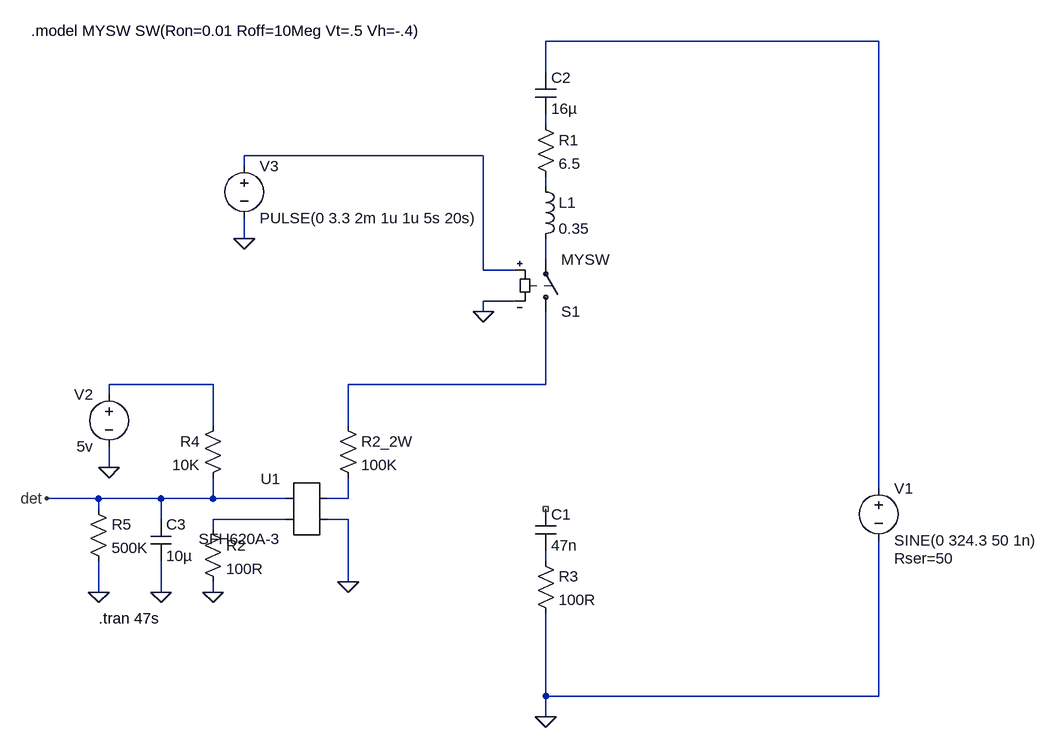
[diagram p0: schematic on_off_det.asc]
on_off_det.asc, the LTspice schematic file:
Version 4
SHEET 1 908 680
WIRE 432 -384 -80 -384
WIRE -80 -336 -80 -384
WIRE -80 -256 -80 -272
WIRE -176 -208 -544 -208
WIRE -544 -192 -544 -208
WIRE -80 -160 -80 -176
WIRE -544 -80 -544 -112
WIRE -80 -48 -80 -80
WIRE -176 -32 -176 -208
WIRE -128 -32 -176 -32
WIRE -128 16 -176 16
WIRE -176 32 -176 16
WIRE -592 144 -752 144
WIRE -80 144 -80 32
WIRE -80 144 -384 144
WIRE -752 160 -752 144
WIRE -592 208 -592 144
WIRE -384 208 -384 144
WIRE -752 272 -752 240
WIRE 432 304 432 -384
WIRE -768 320 -848 320
WIRE -672 320 -768 320
WIRE -592 320 -592 288
WIRE -592 320 -672 320
WIRE -480 320 -592 320
WIRE -384 320 -384 288
WIRE -384 320 -416 320
WIRE -768 336 -768 320
WIRE -672 352 -672 320
WIRE -480 352 -592 352
WIRE -384 352 -416 352
WIRE -592 368 -592 352
WIRE -80 416 -80 400
WIRE -384 448 -384 352
WIRE -768 464 -768 416
WIRE -672 464 -672 416
WIRE -592 464 -592 448
WIRE -80 624 -80 496
WIRE 432 624 432 384
WIRE 432 624 -80 624
WIRE -80 656 -80 624
FLAG -80 656 0
FLAG -384 448 0
FLAG -752 272 0
FLAG -848 320 det
FLAG -592 464 0
FLAG -544 -80 0
FLAG -176 32 0
FLAG -672 464 0
FLAG -768 464 0
SYMBOL voltage 432 288 R0
WINDOW 123 0 0 Left 2
WINDOW 39 24 124 Left 2
SYMATTR SpiceLine Rser=50
SYMATTR InstName V1
SYMATTR Value SINE(0 324.3 50 1n)
SYMBOL cap -96 336 R0
SYMATTR InstName C1
SYMATTR Value 47n
SYMBOL res -96 400 R0
SYMATTR InstName R3
SYMATTR Value 100R
SYMBOL ind -96 -176 R0
SYMATTR InstName L1
SYMATTR Value 0.35
SYMBOL cap -96 -336 R0
SYMATTR InstName C2
SYMATTR Value 16µ
SYMBOL res -96 -272 R0
SYMATTR InstName R1
SYMATTR Value 6.5
SYMBOL sw -80 48 M180
SYMATTR InstName S1
SYMATTR Value MYSW
SYMBOL AutoGenerated\\SFH620A-3 -448 336 M0
SYMATTR InstName U1
SYMBOL res -400 192 R0
SYMATTR InstName R2_2W
SYMATTR Value 100K
SYMATTR SpiceLine pwr=1W
SYMBOL voltage -752 144 M0
WINDOW 123 0 0 Left 2
WINDOW 39 0 0 Left 2
SYMATTR InstName V2
SYMATTR Value 5v
SYMBOL res -576 192 M0
SYMATTR InstName R4
SYMATTR Value 10K
SYMBOL voltage -544 -208 R0
WINDOW 123 0 0 Left 2
WINDOW 39 0 0 Left 2
SYMATTR InstName V3
SYMATTR Value PULSE(0 3.3 2m 1u 1u 5s 20s)
SYMBOL cap -688 352 R0
SYMATTR InstName C3
SYMATTR Value 10µ
SYMBOL res -784 320 R0
SYMATTR InstName R5
SYMATTR Value 500K
SYMBOL res -608 352 R0
SYMATTR InstName R2
SYMATTR Value 100R
TEXT -768 504 Left 2 !.tran 47s
TEXT -872 -400 Left 2 !.model MYSW SW(Ron=0.01 Roff=10Meg Vt=.5 Vh=-.4)

The netlist it stands for:
* on_off_det.asc
V1 N001 0 SINE(0 324.3 50 1n) Rser=50
C1 NC_01 N010 47n
R3 N010 0 100R
L1 N004 N005 0.35
C2 N001 N002 16µ
R1 N002 N004 6.5
S1 N007 N005 N003 0 MYSW
* U1: SFH620A-3 (symbol AutoGenerated\SFH620A-3 not available, pins judged from their places): pin1=N008 pin2=0 pin3=det pin4=N009
R2_2W N007 N008 100K pwr=1W
V2 N006 0 5v
R4 N006 det 10K
V3 N003 0 PULSE(0 3.3 2m 1u 1u 5s 20s)
C3 det 0 10µ
R5 det 0 500K
R2 N009 0 100R
.tran 47s
.model MYSW SW(Ron=0.01 Roff=10Meg Vt=.5 Vh=-.4)
.backanno
.end